# Altium project MAX96717_COUPON_V2.PrjPcb
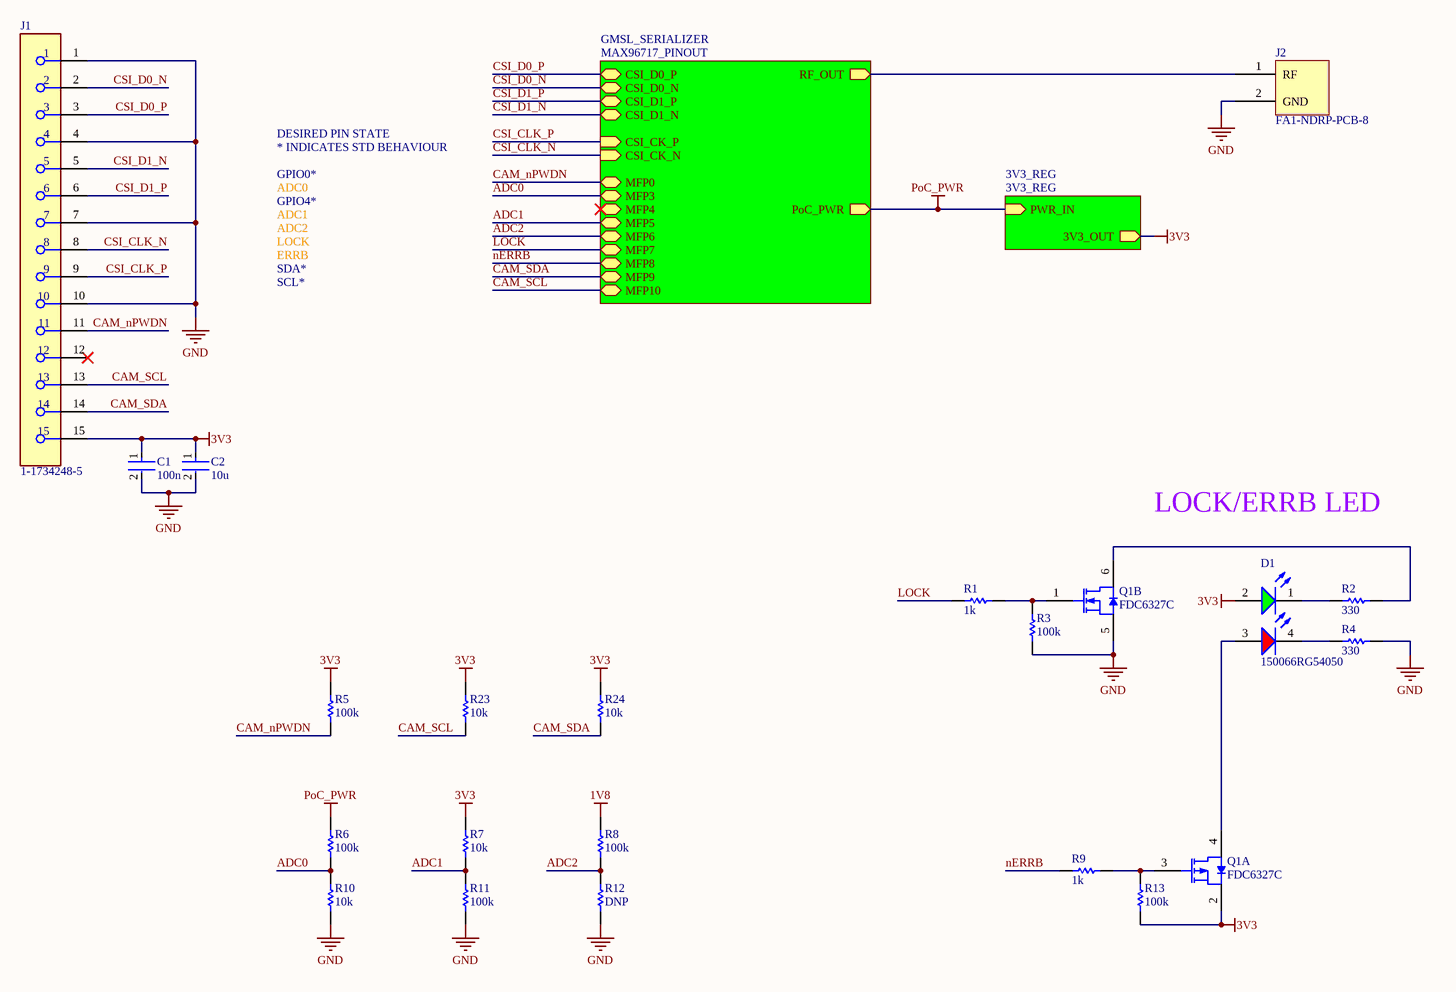
[diagram p0: MAX96717_COUPON_V2.SchDoc]
3 sheets, 67 parts. Net scope: hierarchical (ports join the sheet entries above them; power ports are global).
Board file: MAX96717_COUPON_V2.PcbDoc
Sheets:
  MAX96717_COUPON_V2.SchDoc
    GMSL_SERIALIZER = MAX96717_PINOUT.SchDoc
    3V3_REG = 3V3_REG.SchDoc

## Sheet MAX96717_COUPON_V2.SchDoc
size B; SheetNumber: 1; SheetTotal: 3

### Parts
C1  100n  [FP-0402-L_1_0_0_05-W_0_5-IPC_A]
C2  10u  [FP-0402-L_1_0_0_05-W_0_5-IPC_A]
D1  150066RG54050  [WL-SBCD_0606]
J1  1-1734248-5  [FP-1-1734248-5-MFG]
J2  FA1-NDRP-PCB-8  [FA1-NDRP-PCB-8-Footprint-1]
Q1  FDC6327C  [FAIR-SOT23-6_V]  (parts A,B of 2)
R1  1k  [R0603B]
R2  330  [R0603B]
R3  100k  [R0603B]
R4  330  [R0603B]
R5  100k  [R0603B]
R6  100k  [R0603B]
R7  10k  [R0603B]
R8  100k  [R0603B]
R9  1k  [R0603B]
R10  10k  [R0603B]
R11  100k  [R0603B]
R12  DNP  [R0603B]
R13  100k  [R0603B]
R23  10k  [R0603B]
R24  10k  [R0603B]

### Sub-sheets
3V3_REG = 3V3_REG: PWR_IN (in), 3V3_OUT (out)
GMSL_SERIALIZER = MAX96717_PINOUT: CSI_D0_P (bidir), CSI_D0_N (bidir), CSI_D1_P (bidir), CSI_D1_N (bidir), CSI_CK_P (in), CSI_CK_N (in), RF_OUT (out), PoC_PWR (out), MFP0 (bidir), MFP3 (bidir), MFP4 (bidir), MFP5 (bidir), MFP6 (bidir), MFP7 (bidir), MFP8 (bidir), MFP9 (bidir), MFP10 (bidir)

### Nets
1V8: R8.2
3V3: C1.1 C2.1 D1.2(A) J1.15 Q1.2(S) R5.2 R7.2 R13.1 R23.2 R24.2 ; sheet 3V3_REG/3V3_OUT
GND: C1.2 C2.2 J1.1 J1.4 J1.7 J1.10 J2.2(GND) Q1.5(S) R3.2 R4.1 R10.1 R11.1 R12.1
PoC_PWR: R6.2 ; sheet GMSL_SERIALIZER/PoC_PWR, sheet 3V3_REG/PWR_IN
ADC0: R6.1 R10.2 ; sheet GMSL_SERIALIZER/MFP3
ADC1: R7.1 R11.2 ; sheet GMSL_SERIALIZER/MFP5
ADC2: R8.1 R12.2 ; sheet GMSL_SERIALIZER/MFP6
CAM_nPWDN: J1.11 R5.1 ; sheet GMSL_SERIALIZER/MFP0
CAM_SCL: J1.13 R23.1 ; sheet GMSL_SERIALIZER/MFP10
CAM_SDA: J1.14 R24.1 ; sheet GMSL_SERIALIZER/MFP9
CSI_CLK_N: J1.8 ; sheet GMSL_SERIALIZER/CSI_CK_N
CSI_CLK_P: J1.9 ; sheet GMSL_SERIALIZER/CSI_CK_P
CSI_D0_N: J1.2 ; sheet GMSL_SERIALIZER/CSI_D0_N
CSI_D0_P: J1.3 ; sheet GMSL_SERIALIZER/CSI_D0_P
CSI_D1_N: J1.5 ; sheet GMSL_SERIALIZER/CSI_D1_N
CSI_D1_P: J1.6 ; sheet GMSL_SERIALIZER/CSI_D1_P
LOCK: R1.2 ; sheet GMSL_SERIALIZER/MFP7
nERRB: R9.1 ; sheet GMSL_SERIALIZER/MFP8
PoC_TAP: J2.1(RF) ; sheet GMSL_SERIALIZER/RF_OUT
NetD1_1: D1.1(K) R2.2
NetD1_3: D1.3(A) Q1.4(D)
NetD1_4: D1.4(K) R4.2
NetQ1_1: Q1.1(G) R1.1 R3.1
NetQ1_3: Q1.3(G) R9.2 R13.2
NetQ1_6: Q1.6(D) R2.1

Not connected (* = marked no-connect by the designer): J1 12*

### Notes on the sheet
- DESIRED PIN STATE
- * INDICATES STD BEHAVIOUR
- GPIO0*
- ADC0
- GPIO4*
- ADC1
- ADC2
- LOCK
- ERRB
- SDA*
- SCL*
- LOCK/ERRB LED

### Library data of the parts
C1 C2 = CMP-001-00058-1: LARGE PADS, 0402 CAP, CHANGE COMMENT TO MATCH REAL P/N; Capacitor Type: Ceramic; Min Operating Temperature: -55°C; Mounting Technology: Surface Mount; Pins: 2; Case/Package: 0402; RoHS Compliant: Yes; Max Operating Temperature: 85°C
D1 = CMP-004-00040-2: Led, Red/Grn, 180Mcd/230Mcd, 624Nm/525Nm Rohs Compliant: Yes; Source: rgled.SchLib; Component Type: Standard; Design Item ID: CMP-004-00034-2; Pins: 4
J1 = CMP-03368-000001-1: CONN FPC VERT 15POS 1.00MM SMD; Manufacturer: TE; Conn Orientation: Vertical; Conn Gender: Female; Current Rating: 1A; Is Female: yes; Number Of Contacts: 15; Pitch: 1mm; Voltage Rating: 125V; ComponentLink2URL: https://www.te.com/commerce/DocumentDelivery/DDEController?Action=showdoc&DocId=Customer+Drawing%7F1734248%7FE1%7Fpdf%7FEnglish%7FENG_CD_1734248_E1__.pdf%7F1-1734248-5; Device Class L1: Connectors; Category: Conn; Package: 0; Lead Free: Yes; Digikey Description: CONN FPC VERT 15POS 1.00MM SMD; Height: 8mm; Manufacturer Part Number: 1-1734248-5; Temperature: -20°C to +85°C; Contact Material: Gold,Nickel; Device Class L3: unset; ComponentLink2Description: Datasheet; RoHS: TRUE; Temperature Range Low: -20°C; Octopart: https://octopart.com/1-1734248-5-te+connectivity-40620898; Device Class L2: FFC / FPC; Mouser Description: FFC & FPC Connectors 15P 1.0 FPC, Zip V/T SMT; Automotive: No; Temperature Range High: +85°C; Mounting Type: Surface Mount
J2 = CMP-002-00054-1: RF F Connector, Male, Board Mount, Solder Terminal, Plug; Connector Type: RF F CONNECTOR; RoHS Compliant: Yes; Mounting Technology: Board
Q1 = CMP-2000-04939-1: Dual N & P-Channel 2.5 V Specified PowerTrench(TM) MOSFET, -55 to 150 degC, 6-Pin SOT-23, RoHS, Tape and Reel; Manufacturer: Fairchild; Typical Rise Time: 9@NChannel; Rad Hard: No; Maximum Drain Source Voltage: 20V; Typical Fall Time: 3@NChannel; Typical Turn-On Delay Time: 5@NChannel; Maximum Continuous Drain Current: 2.7@NChannel; Typical Turn-Off Delay Time: 12@NChannel; RDS-on: 80@4.5V@NChannel; Channel Mode: Enhancement; Maximum Gate Source Voltage: ±8V; Package Version: Rev. 5, 05/2015; Operating Temperature: -55to150degC; Packaging: Tape&Reel; Package Reference: SOT23-6; Package URL: https://www.fairchildsemi.com/package-drawings/MA/MA06A.pdf; Package Description: 6-Pin Small Outline Transistor, Body 2.9 x 1.6 mm, Pitch 0.95 mm; Manufacturer URL: https://www.fairchildsemi.com/; Channel Type: N; Datasheet Version: Rev. E, 07/2000; Package: 6SuperSOT; Datasheet URL: https://www.fairchildsemi.com/datasheets/FD/FDC6327C.pdf; Mounting: SurfaceMount; Category: MOSFET
R1-R6 R8 R9 R11 R13 = CMP-009-00002-14: Resistor
  R5 R6 R8 R11: Value: 100k
R7 R10 R12 R23 R24 = CMP-009-00002-14: Resistor; Value: 100k

## Sheet MAX96717_PINOUT.SchDoc
size C; SheetNumber: 3; SheetTotal: 3
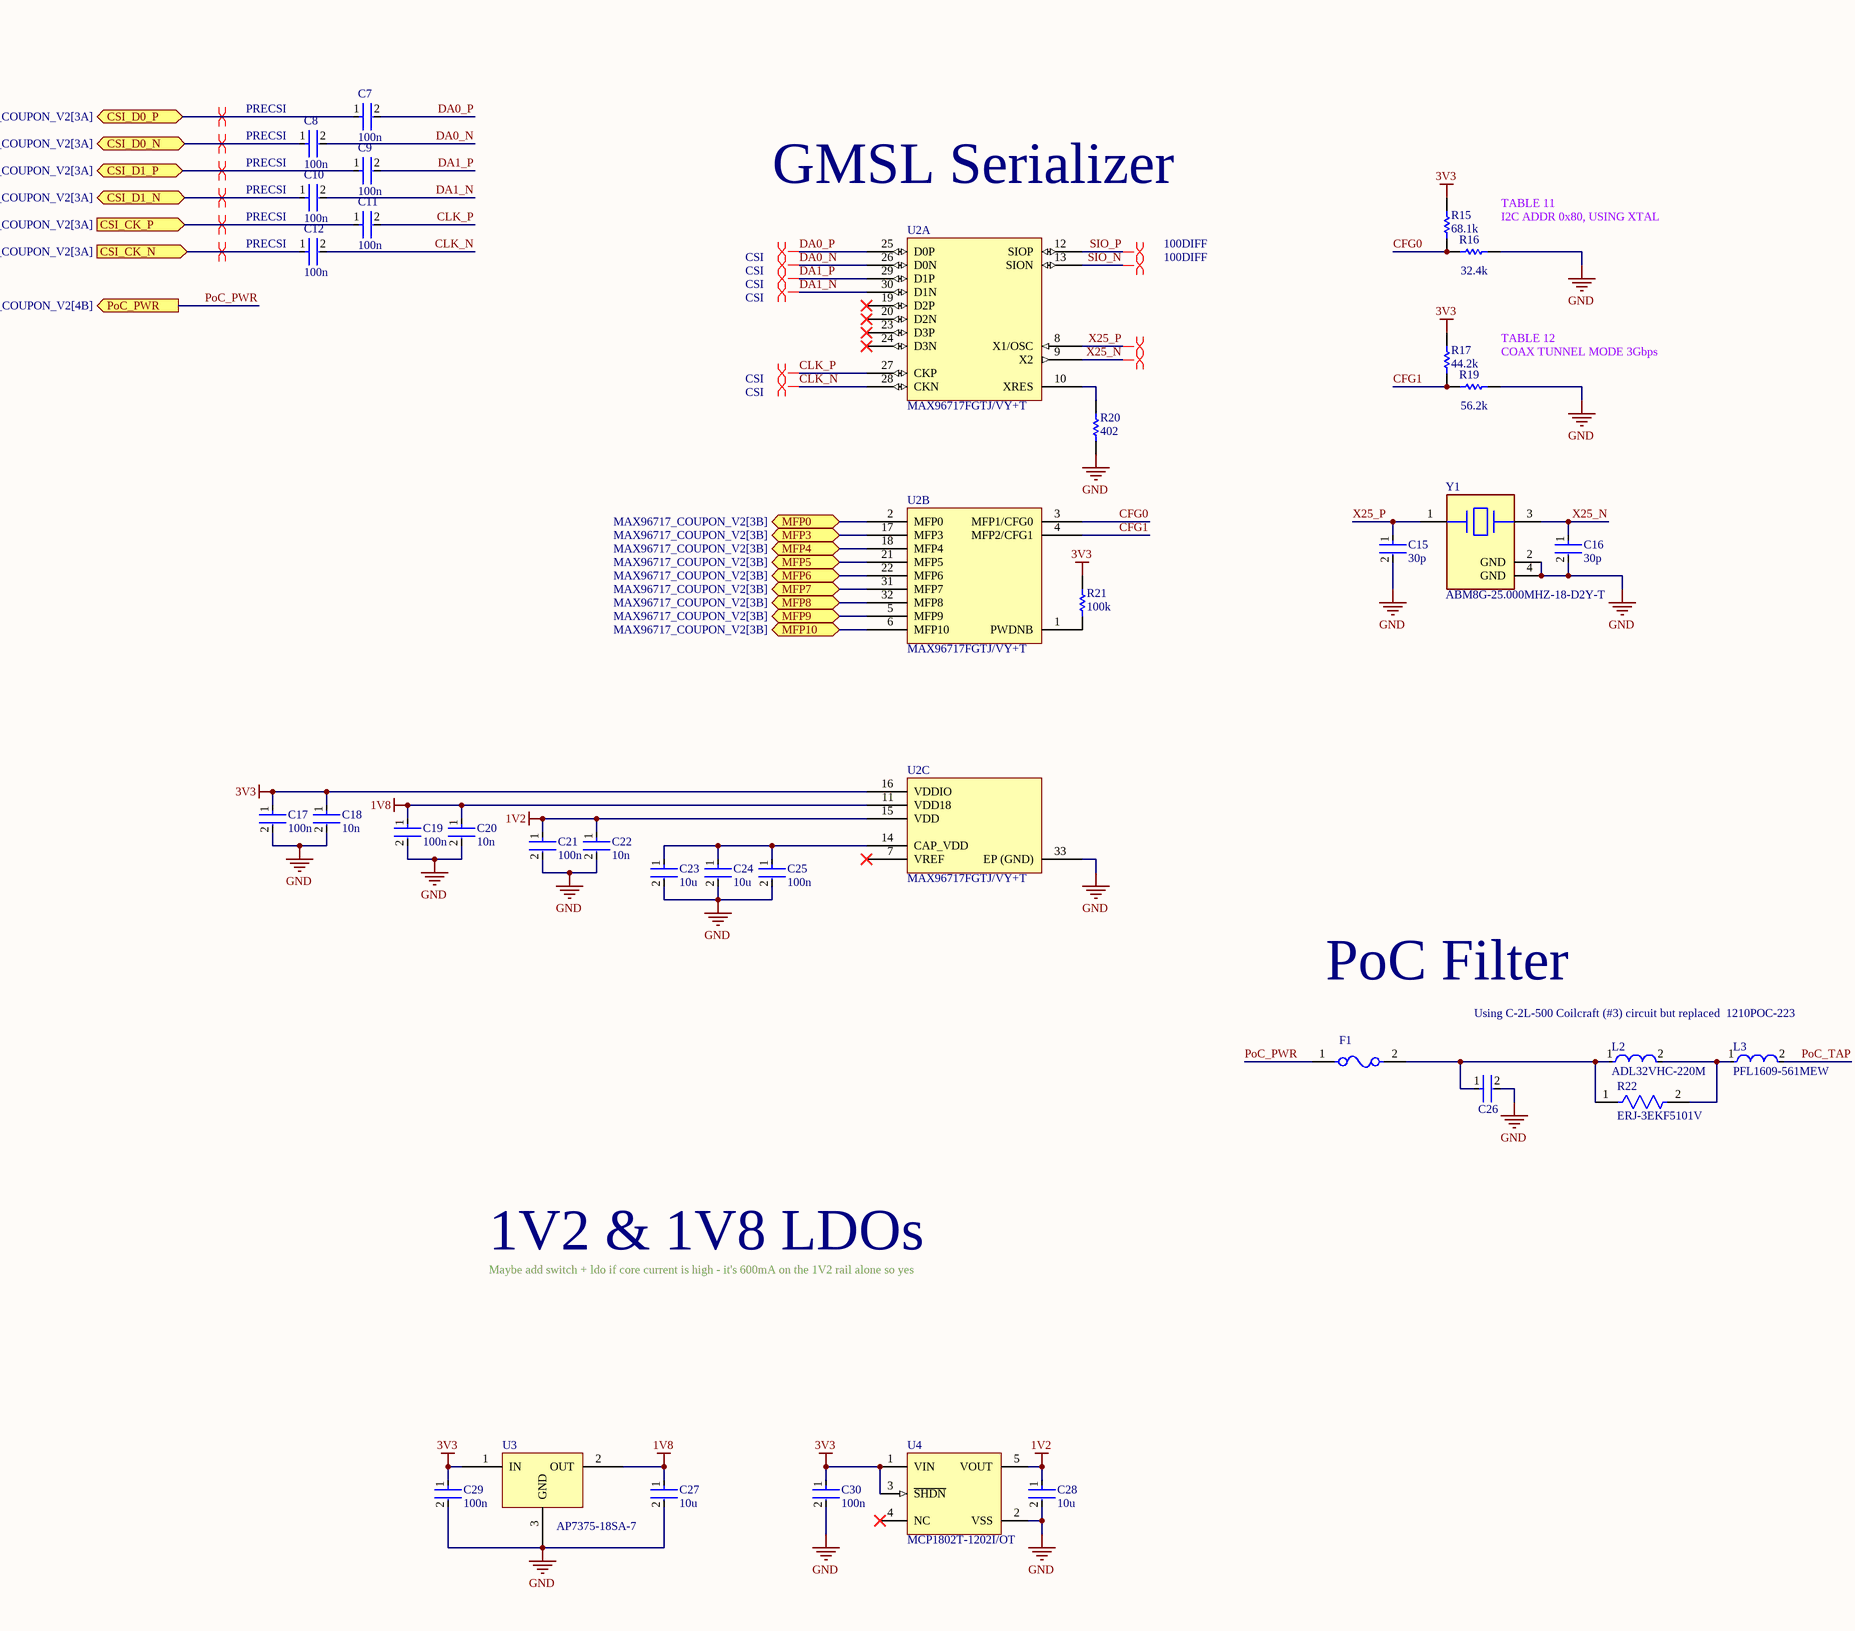
[diagram p1: MAX96717_PINOUT.SchDoc, left]
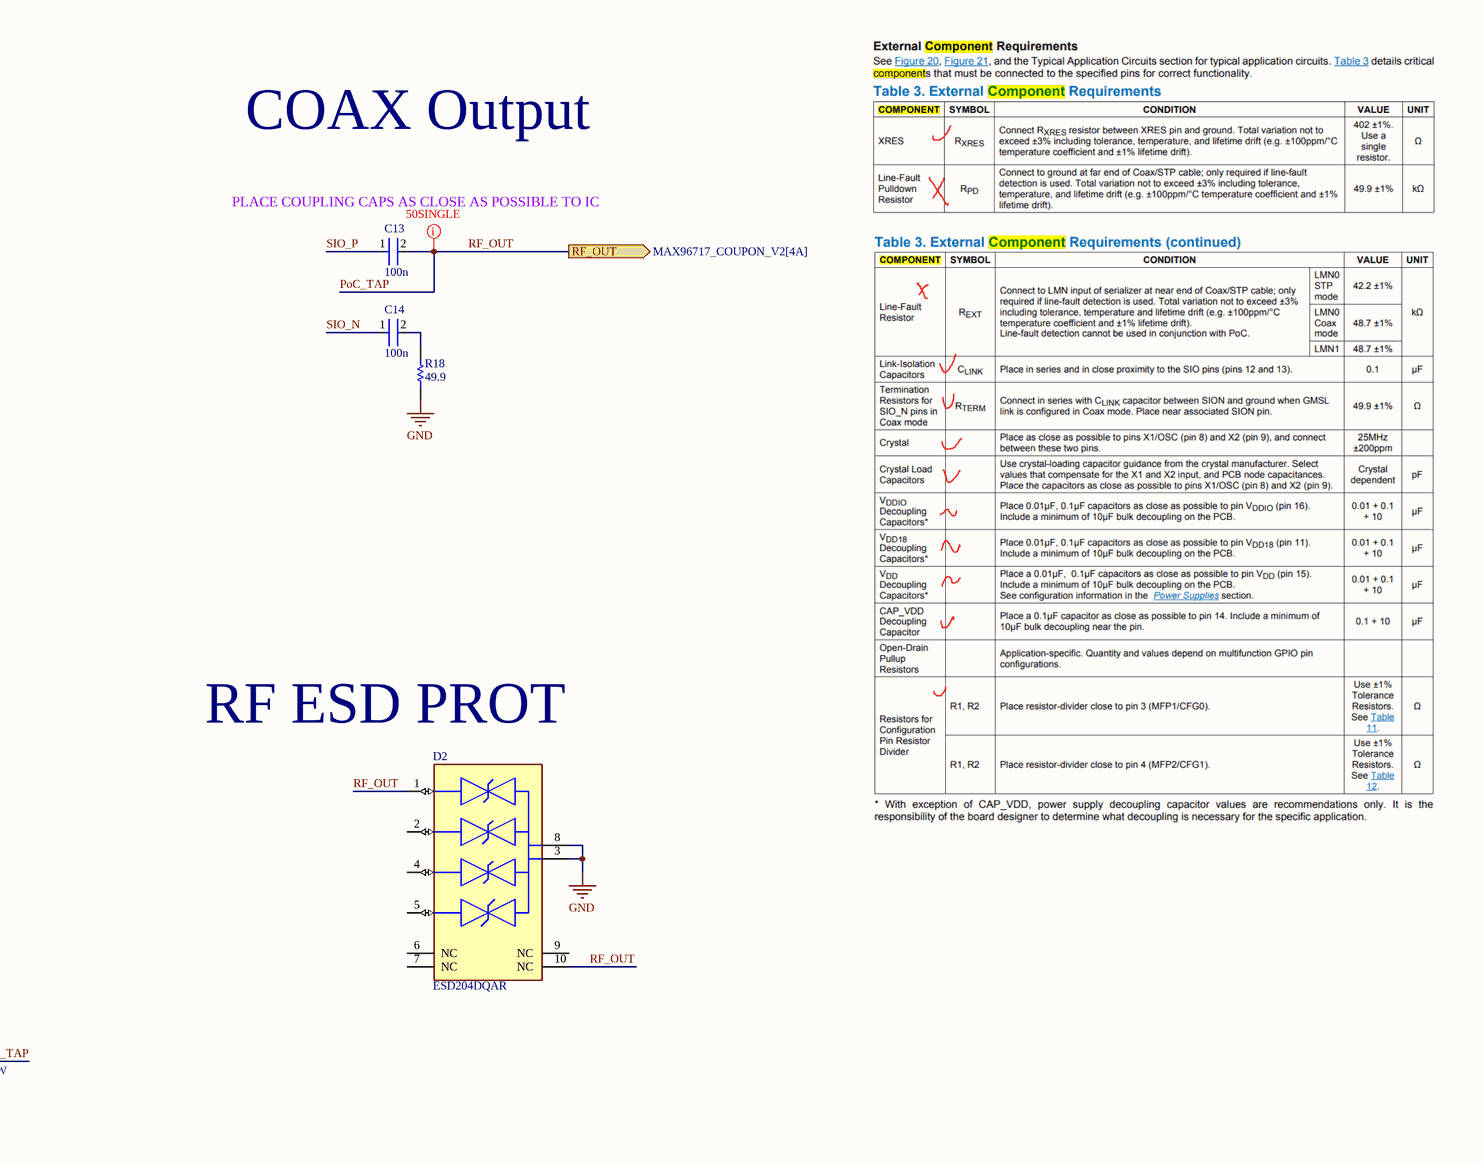
[diagram p2: MAX96717_PINOUT.SchDoc, right]

### Parts
C7  100n  [FP-0402-L_1_0_0_05-W_0_5-IPC_A]
C8  100n  [FP-0402-L_1_0_0_05-W_0_5-IPC_A]
C9  100n  [FP-0402-L_1_0_0_05-W_0_5-IPC_A]
C10  100n  [FP-0402-L_1_0_0_05-W_0_5-IPC_A]
C11  100n  [FP-0402-L_1_0_0_05-W_0_5-IPC_A]
C12  100n  [FP-0402-L_1_0_0_05-W_0_5-IPC_A]
C13  100n  [FP-0402-L_1_0_0_05-W_0_5-IPC_A]
C14  100n  [FP-0402-L_1_0_0_05-W_0_5-IPC_A]
C15  30p  [FP-0402-L_1_0_0_05-W_0_5-IPC_A]
C16  30p  [FP-0402-L_1_0_0_05-W_0_5-IPC_A]
C17  100n  [FP-0402-L_1_0_0_05-W_0_5-IPC_A]
C18  10n  [FP-0402-L_1_0_0_05-W_0_5-IPC_A]
C19  100n  [FP-0402-L_1_0_0_05-W_0_5-IPC_A]
C20  10n  [FP-0402-L_1_0_0_05-W_0_5-IPC_A]
C21  100n  [FP-0402-L_1_0_0_05-W_0_5-IPC_A]
C22  10n  [FP-0402-L_1_0_0_05-W_0_5-IPC_A]
C23  10u  [FP-0402-L_1_0_0_05-W_0_5-IPC_A]
C24  10u  [FP-0402-L_1_0_0_05-W_0_5-IPC_A]
C25  100n  [FP-0402-L_1_0_0_05-W_0_5-IPC_A]
C26  GRM21BR61E226ME44L  [FP-GRM21B-0_2-e0_2_0_7-IPC_B]  (value not drawn)
C27  10u  [FP-0402-L_1_0_0_05-W_0_5-IPC_A]
C28  10u  [FP-0402-L_1_0_0_05-W_0_5-IPC_A]
C29  100n  [FP-0402-L_1_0_0_05-W_0_5-IPC_A]
C30  100n  [FP-0402-L_1_0_0_05-W_0_5-IPC_A]
D2  ESD204DQAR  [FP-DQA0010A-MFG]
F1  MF-FSMF050X-2  [FP-MF-FSMF-MFG]  (value not drawn)
L2  ADL32VHC-220M  [FP-1210POC-MFG]
L3  PFL1609-561MEW  [FP-PFL1609-MFG]
R15  68.1k  [R0603B]
R16  32.4k  [R0603B]
R17  44.2k  [R0603B]
R18  49.9  [R0603B]
R19  56.2k  [R0603B]
R20  402  [R0603B]
R21  100k  [R0603B]
R22  ERJ-3EKF5101V  [FP-ERJ3EK-MFG]
U2  MAX96717FGTJ/VY+T  [QFN50P500X500X80_HS-33N]  (parts A,B,C of 3)
U3  AP7375-18SA-7  [AP7375-18SA-7-Footprint-1]
U4  MCP1802T-1202I/OT  [SOT-23-OT5_M]
Y1  ABM8G-25.000MHZ-18-D2Y-T  [FP-ABM8G-MFG]

### Ports
CSI_CK_N (in, see MAX96717_COUPON_V2[3A]), CSI_CK_P (in, see MAX96717_COUPON_V2[3A]), CSI_D0_N (bidir, see MAX96717_COUPON_V2[3A]), CSI_D0_P (bidir, see MAX96717_COUPON_V2[3A]), CSI_D1_N (bidir, see MAX96717_COUPON_V2[3A]), CSI_D1_P (bidir, see MAX96717_COUPON_V2[3A]), MFP0 (bidir, see MAX96717_COUPON_V2[3B]), MFP3 (bidir, see MAX96717_COUPON_V2[3B]), MFP4 (bidir, see MAX96717_COUPON_V2[3B]), MFP5 (bidir, see MAX96717_COUPON_V2[3B]), MFP6 (bidir, see MAX96717_COUPON_V2[3B]), MFP7 (bidir, see MAX96717_COUPON_V2[3B]), MFP8 (bidir, see MAX96717_COUPON_V2[3B]), MFP9 (bidir, see MAX96717_COUPON_V2[3B]), MFP10 (bidir, see MAX96717_COUPON_V2[3B]), PoC_PWR (out, see MAX96717_COUPON_V2[4B]), RF_OUT (out, see MAX96717_COUPON_V2[4A])

### Nets
1V2: C21.1 C22.1 C28.1 U2.15(VDD) U4.5(VOUT)
1V8: C19.1 C20.1 C27.1 U2.11(VDD18) U3.2(OUT)
3V3: C17.1 C18.1 C29.1 C30.1 R15.2 R17.2 R21.2 U2.16(VDDIO) U3.1(IN) U4.1(VIN) U4.3(~{SHDN})
GND: C15.2 C16.2 C17.2 C18.2 C19.2 C20.2 C21.2 C22.2 C23.2 C24.2 C25.2 C26.2 C27.2 C28.2 C29.2 C30.2 D2.3(GND) D2.8(GND) R16.1 R18.1 R19.1 R20.1 U2.33(EP_(GND)) U3.3(GND) U4.2(VSS) Y1.2(GND) Y1.4(GND)
PoC_PWR: F1.1 ; port PoC_PWR
ADC0: U2.17(MFP3) ; port MFP3
ADC1: U2.21(MFP5) ; port MFP5
ADC2: U2.22(MFP6) ; port MFP6
CAM_nPWDN: U2.2(MFP0) ; port MFP0
CAM_SCL: U2.6(MFP10) ; port MFP10
CAM_SDA: U2.5(MFP9) ; port MFP9
CFG0: R15.1 R16.2 U2.3(MFP1/CFG0)
CFG1: R17.1 R19.2 U2.4(MFP2/CFG1)
CLK_N: C12.2 U2.28(CKN)
CLK_P: C11.2 U2.27(CKP)
CSI_CLK_N: C12.1 ; port CSI_CK_N
CSI_CLK_P: C11.1 ; port CSI_CK_P
CSI_D0_N: C8.1 ; port CSI_D0_N
CSI_D0_P: C7.1 ; port CSI_D0_P
CSI_D1_N: C10.1 ; port CSI_D1_N
CSI_D1_P: C9.1 ; port CSI_D1_P
DA0_N: C8.2 U2.26(D0N)
DA0_P: C7.2 U2.25(D0P)
DA1_N: C10.2 U2.30(D1N)
DA1_P: C9.2 U2.29(D1P)
LOCK: U2.31(MFP7) ; port MFP7
nERRB: U2.32(MFP8) ; port MFP8
PoC_TAP: C13.2 D2.1(IO1) D2.10(NC) L3.2 ; port RF_OUT  [also labelled RF_OUT]
SIO_N: C14.1 U2.13(SION)
SIO_P: C13.1 U2.12(SIOP)
X25_N: C16.1 U2.9(X2) Y1.3
X25_P: C15.1 U2.8(X1/OSC) Y1.1
NetC14_2: C14.2 R18.2
NetC23_1: C23.1 C24.1 C25.1 U2.14(CAP_VDD)
NetC26_1: C26.1 F1.2 L2.1 R22.1
NetL2_2: L2.2 L3.1 R22.2
NetR20_2: R20.2 U2.10(XRES)
NetR21_1: R21.1 U2.1(PWDNB)
NetU2_18: U2.18(MFP4) ; port MFP4

Not connected (* = marked no-connect by the designer): D2 2(IO2) 4(IO3) 5(IO4) 6(NC) 7(NC) 9(NC); U2 7(VREF)* 19(D2P)* 20(D2N)* 23(D3P)* 24(D3N)*; U4 4(NC)*

### Layout directives
differential pair: X25_N, X25_P
differential pair; differential pair class CSI: CLK_N, CLK_P, DA0_N, DA0_P, DA1_N, DA1_P
differential pair; differential pair class 100DIFF: SIO_N, SIO_P
differential pair; differential pair class PRECSI: CSI_CLK_N, CSI_CLK_P, CSI_D0_N, CSI_D0_P, CSI_D1_N, CSI_D1_P
net class 50SINGLE: PoC_TAP

### Notes on the sheet
- COAX Output
- GMSL Serializer
- TABLE 11
- (near C13) PLACE COUPLING CAPS AS CLOSE AS POSSIBLE TO IC
- (near R16) I2C ADDR 0x80, USING XTAL
- TABLE 12
- (near R19) COAX TUNNEL MODE 3Gbps
- RF ESD PROT
- PoC Filter
- Using C-2L-500 Coilcraft (#3) circuit but replaced  1210POC-223
- 1V2 & 1V8 LDOs
- Maybe add switch + ldo if core current is high - it's 600mA on the 1V2 rail alone so yes

### Library data of the parts
C7-C25 C27-C30 = CMP-001-00058-1: as C1 on sheet MAX96717_COUPON_V2; Min Operating Temperature: -55°C; Mounting Technology: Surface Mount; Pins: 2; Case/Package: 0402; RoHS Compliant: Yes; Max Operating Temperature: 85°C
C26 = CMP-2007-03222-3: Chip Multilayer Ceramic Capacitors for General Purpose, 0805, 22uF, X5R, 15%, 20%, 25V; Case/Package: 0805; Depth: 1.25mm; Resistor Type: Ceramic; Voltage Rating: 25V; Lead Free: Lead Free; Voltage Rating (DC): 25V; Case Code (Metric): 2012; Thickness: 0.057inch; REACH SVHC: No SVHC; Material: Ceramic; Tolerance: 20%; Length: 2mm; Capacitance: 22uF; Case Code (Imperial): 0805; Max Operating Temperature: 85°C; Termination: SMD/SMT; Weight: 0.000335oz; Dielectric: X5R; Packaging: Tape and Reel; Voltage: 25V; Package Quantity: 3000; Height: 1.25mm; Mount: Surface Mount; Width: 1.25mm; Min Operating Temperature: -55°C
D2 = CMP-04989-000002-1: 4-CHANNEL LOW-CAPACITANCE SURGE; Manufacturer: Texas Instruments; Value: 0.55pF; Reverse Standoff Voltage: 3.6V; Standoff Height: 0mm; Breakdown Voltage: 5.5V; Peak Pulse Current: 5.5A; Clamping Voltage: 11.5V; Direction: Bidirectional; Peak Pulse Power: 50W; Number Of Channels: 4; Ambient Temperature Range High: +125°C; ComponentLink2Description: Datasheet; Height: 0.55mm; Lead Free: Yes; Device Class L3: unset; Temperature Range High: +125°C; Temperature Range Low: -40°C; Package: DQA0010A; Temperature: -40°C to +125°C; Capacitance: 0.55pF; RoHS: TRUE; Mouser Description: 4-Channel Low-Capacitance Surge and ESD Protection Diode 10-USON -40 to 125; Category: Diode; Device Class L1: Circuit Protection; Octopart: https://octopart.com/esd204dqar-texas+instruments-89917476; Device Class L2: TVS Diodes; Ambient Temperature Range Low: -40°C; Manufacturer Part Number: ESD204DQAR; ComponentLink2URL: http://www.ti.com/lit/ds/symlink/esd204.pdf; Automotive: No; Digikey Description: 4-CHANNEL LOW-CAPACITANCE SURGE
F1 = CMP-07400-000010-1: PTC RESET FUSE 6V 500MA 0603; Manufacturer: Bourns Inc.; Trip Current: 1A; Current Rating: 40A; Hold Current: 0.5A; Resistance: 0.1-0.8Ω; Value: 0.1-0.8Ω; Trip Time: 0.1s; Mouser Description: Resettable Fuses - PPTC 6volts 40amps; Category: Fuse; Digikey Description: PTC RESET FUSE 6V 500MA 0603; Temperature: -40°C to +85°C; Device Class L3: unset; Automotive: No; RoHS: TRUE; Ambient Temperature Range High: +85°C; Device Class L2: PTC Resettable Fuses; Temperature Range High: +85°C; Voltage Rating: 6V; Package: MF-FSMF; Manufacturer Part Number: MF-FSMF050X-2; Ambient Temperature Range Low: -40°C; Lead Free: Yes; ComponentLink2Description: Datasheet; Octopart: https://octopart.com/mf-fsmf050x-2-bourns-10470804; ComponentLink2URL: https://www.bourns.com/docs/Product-Datasheets/mffsmf.pdf; Temperature Range Low: -40°C; Height: 1mm; Device Class L1: Circuit Protection
L2 = CMP-11268-000041-1: NOT COILCRAFT - ACTUAL P# --> ADL32VHC-220M / - Power Injection Chokes for PoC; Manufacturer Part Number: 1210POC-223MRC; Value: 22uH; Core Material: Ferrite; Saturation Current: 720mA; Series Resistance: 0.88Ω; Rms Current: 700mA; Automotive Grade: Grade 1; Self Resonant Frequency: 70MHz; Test Frequency: 100kHz; Tolerance: 20%; Ambient Temperature Range High: +125°C; Manufacturer: coilcraft; Octopart: https://octopart.com/1210poc-223mrc-coilcraft-103207315; Category: Ind; Device Class L2: Inductors; RoHS: TRUE; Device Class L3: Fixed Inductors; Package: 1210POC; Ambient Temperature Range Low: -40°C; ComponentLink2URL: https://drive.google.com/open?id=15FlOq8Y4YbRFohfA_cJ40jgnqs8va2Mh; Lead Free: Yes; Inductance: 22uH; Device Class L1: Passive Components; ComponentLink2Description: Datasheet; Automotive: Yes; Height: 3mm
L3 = CMP-11268-000007-1: Fixed Inductors PFL1609 Low Profile 0.56 uH 20 % 1.4 A; Manufacturer: coilcraft; Rms Current: 1100mA; Self Resonant Frequency: 600MHz; Core Material: Composite; Tolerance: 20%; Value: 0.56uH; Automotive Grade: Grade 1; Saturation Current: 710mA; Test Frequency: 7.9MHz; Shielding: true; Series Resistance: 130mΩ; Lead Free: Yes; Device Class L1: Passive Components; Package: PFL1609; Octopart: https://octopart.com/pfl1609-561mew-coilcraft-20329171; ComponentLink2URL: https://www.coilcraft.com/pdfs/pfl1609.pdf; Manufacturer Part Number: PFL1609-561MEW; Ambient Temperature Range Low: -40°C; Composition: Wirewound; Inductance: 0.56uH; Device Class L2: Inductors; Category: Ind; Device Class L3: Fixed Inductors; Mouser Description: Fixed Inductors PFL1609 Low Profile 0.56 uH 20 % 1.4 A; Automotive: Yes; ComponentLink2Description: Datasheet; Ambient Temperature Range High: +105°C; Height: 0.95mm; RoHS: TRUE
R15-R20 = CMP-009-00002-14: Resistor; Value: 100k
R21 = CMP-009-00002-14: Resistor; Value: 100k
R22 = CMP-2000-00540-8: RES SMD 5.1K OHM 1% 1/10W 0603; Power Rating: 100mW; Temperature Coefficient: 100ppm/°C; Voltage Rating: 75V; Resistance: 5.1kR; Military Standard: Not; Case/Package: 0603; Packaging: Tape and Reel; Package Quantity: 1; Reach SVHC Compliant: Yes; Lead Free: Lead Free; Mount: Surface Mount; Size Code: 0603; Depth: 0.8mm; Resistance Tolerance: 1%; Number of Terminations: 2; Resistor Type: Thick Film; Width: 0.8mm; Construction: Rectangular; Series: ERJ; Radiation Hardening: No; Max Operating Temperature: 155°C; Features: Automotive AEC-Q200; Tolerance: 1%; Voltage Rating (DC): 75V; Length: 1.6mm; RoHS Compliant: Yes; Min Operating Temperature: -55°C; Case Code (Metric): 1608; Termination: SMD/SMT; Weight: 7.1E-05oz; Max Power Dissipation: 100mW; Contact Plating: Tin; Height: 0.022inch; Case Code (Imperial): 0603
U2 = CMP-015-00012-2: 3Gbps Serializer TQFN-32 Serializers / Deserializers ROHS
U3 = CMP-019-00042-1: Fixed Positive LDO Regulator; RoHS Compliant: Yes
U4 = CMP-0136-00731-1: 300 mA, High PSRR, Low Quiescent Current LDO, 5-Pin SOT-23, Industrial Temperature, Tape and Reel; DatasheetVersion: revB, Jan-2009; PackageReference: SOT-23-OT5; Code_IPC: SOT23-5; PackageDescription: 5-Lead Plastic Small Outline Transistor (OT) [SOT-23]; PackageVersion: revBB, Aug-2009
Y1 = CMP-2000-05733-3: Crystal 25MHz ±20ppm (Tol) ±30ppm (Stability) 18pF FUND 60Ω 4-Pin SMD T/R; Series Resistance: 60R; Length: 3.2mm; Depth: 2.5mm; Packaging: Tape and Reel; Min Operating Temperature: -40°C; Operating Frequency: 25 MHz; Lead Free: Lead Free; Number of Pins: 4; Frequency Tolerance: 20ppm; Radiation Hardening: No; Max Operating Temperature: 85°C; Termination: SMD/SMT; Frequency Stability: 30ppm; Frequency: 25MHz; Series: ABM8G; Mount: Surface Mount; Package Quantity: 1000; Height: 0.039inch; Width: 0.098inch; Case/Package: CSMD; ESR (Equivalent Series Resistance): 60R; Load Capacitance: 18pF; Tolerance: 20ppm

## Sheet 3V3_REG.SchDoc
size A4; SheetNumber: 2; SheetTotal: 3
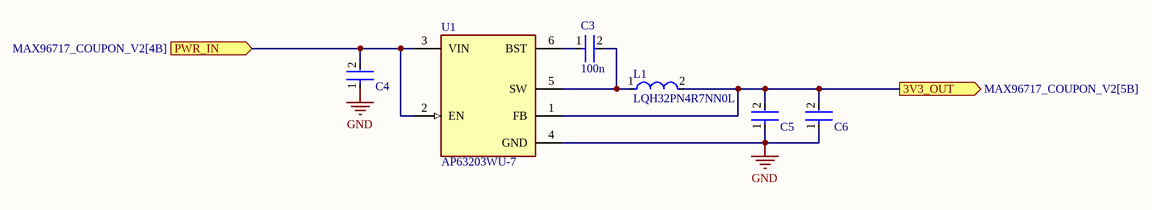
[diagram p3: 3V3_REG.SchDoc]

### Parts
C3  100n  [FP-0402-L_1_0_0_05-W_0_5-IPC_A]
C4  GRM21BR61E226ME44L  [FP-GRM21B-0_2-e0_2_0_7-IPC_B]  (value not drawn)
C5  GRM21BR61E226ME44L  [FP-GRM21B-0_2-e0_2_0_7-IPC_B]  (value not drawn)
C6  GRM21BR61E226ME44L  [FP-GRM21B-0_2-e0_2_0_7-IPC_B]  (value not drawn)
L1  LQH32PN4R7NN0L  [FP-LQH32PB_N0-MFG]
U1  AP63203WU-7  [FP-TSOT26-MFG]

### Ports
3V3_OUT (out, see MAX96717_COUPON_V2[5B]), PWR_IN (in, see MAX96717_COUPON_V2[4B])

### Nets
3V3: C5.2 C6.2 L1.2 U1.1(FB) ; port 3V3_OUT
GND: C4.1 C5.1 C6.1 U1.4(GND)
PoC_PWR: C4.2 U1.2(EN) U1.3(VIN) ; port PWR_IN
NetC3_1: C3.1 U1.6(BST)
NetC3_2: C3.2 L1.1 U1.5(SW)

### Library data of the parts
C3 = CMP-001-00058-1: as C1 on sheet MAX96717_COUPON_V2; Min Operating Temperature: -55°C; Mounting Technology: Surface Mount; Pins: 2; Case/Package: 0402; RoHS Compliant: Yes; Max Operating Temperature: 85°C
C4-C6 = CMP-2007-03222-3: as C26 on sheet MAX96717_PINOUT; Case/Package: 0805; Depth: 1.25mm; Resistor Type: Ceramic; Voltage Rating: 25V; Lead Free: Lead Free; Voltage Rating (DC): 25V; Case Code (Metric): 2012; Thickness: 0.057inch; REACH SVHC: No SVHC; Material: Ceramic; Tolerance: 20%; Length: 2mm; Capacitance: 22uF; Case Code (Imperial): 0805; Max Operating Temperature: 85°C; Termination: SMD/SMT; Weight: 0.000335oz; Dielectric: X5R; Packaging: Tape and Reel; Voltage: 25V; Package Quantity: 3000; Height: 1.25mm; Mount: Surface Mount; Width: 1.25mm; Min Operating Temperature: -55°C
L1 = CMP-06042-015002-1: Wire Wound Ferrite Inductor for Power Lines 4.7μH ±30% 0.216Ω 1000mA 1210; DC Current: 1A; Self Resonant Frequency: 40MHz; Test Frequency: 1MHz; Inductance: 4.7uH; Shielding: Shielded; DC Resistance (DCR): 180mR; Case/Package: 1210; Lead Free: Lead Free; Inductance Tolerance: 30%; Depth: 2.8mm; Radiation Hardening: No; Case Code (Imperial): 1210; Length: 3.2mm; Height - Seated (Max): 0.067inch; Current Rating: 1A; Max DC Current: 1A; Core Material: Ferrite; Resistor Type: Wirewound; Max Operating Temperature: 85°C; Weight: 0.001552oz; Tolerance: 30%; Width: 0.098inch; Mount: Surface Mount; Height: 2mm; Termination: SMD/SMT; Package Quantity: 2000; Min Operating Temperature: -40°C; Saturation Current: 1A; Packaging: Tape and Reel; Case Code (Metric): 3225; REACH SVHC: No SVHC; Military Standard: Not
U1 = CMP-12757-000006-1: IC REG BUCK 3.3V 2A TSOT26; Manufacturer: Diodes Inc.; Output Type: Fixed; Min Supply Voltage: 3.8V; Number Of Outputs: 1; Max Junction Temp: +160°C; Nominal Supply Current: 22uA; Standoff Height: 0.01mm; Switching Frequency: 1.1MHz; Max Supply Voltage: 32V; ComponentLink2Description: Datasheet; Device Class L1: Integrated Circuits (ICs); Temperature: to +160°C; Device Class L3: Voltage Regulators - Switching; RoHS: TRUE; Octopart: https://octopart.com/ap63203wu-7-diodes+inc.-98099550; Output Voltage: 3.3V; Lead Free: Yes; ComponentLink2URL: https://www.diodes.com/assets/Datasheets/AP63200-AP63201-AP63203-AP63205.pdf; Digikey Description: IC REG BUCK 3.3V 2A TSOT26; Footprint Url: https://www.diodes.com/assets/Package-Files/TSOT26.pdf; Ambient Temperature Range High: +85°C; Height: 1mm; Automotive: No; Temperature Range High: +160°C; Switching Topology: Buck; Output Current: 2A; Package: TSOT26; Category: IC; Mouser Description: AP63203 Series 3.3 V 2 A SMT Fixed Low IQ Synchronous Buck - TSOT-26; Device Class L2: Power Management ICs; Ambient Temperature Range Low: -40°C; Manufacturer Part Number: AP63203WU-7

## Nets that join several sheets
1V8: MAX96717_COUPON_V2 (R8.2), MAX96717_PINOUT (5 pins)
3V3: MAX96717_COUPON_V2 (10 pins), MAX96717_PINOUT (11 pins), 3V3_REG (C5.2 C6.2 L1.2 U1.1)
GND: MAX96717_COUPON_V2 (13 pins), MAX96717_PINOUT (27 pins), 3V3_REG (C4.1 C5.1 C6.1 U1.4)
PoC_PWR: MAX96717_COUPON_V2 (R6.2), MAX96717_PINOUT (F1.1), 3V3_REG (C4.2 U1.2 U1.3)
ADC0: MAX96717_COUPON_V2 (R6.1 R10.2), MAX96717_PINOUT (U2.17)
ADC1: MAX96717_COUPON_V2 (R7.1 R11.2), MAX96717_PINOUT (U2.21)
ADC2: MAX96717_COUPON_V2 (R8.1 R12.2), MAX96717_PINOUT (U2.22)
CAM_nPWDN: MAX96717_COUPON_V2 (J1.11 R5.1), MAX96717_PINOUT (U2.2)
CAM_SCL: MAX96717_COUPON_V2 (J1.13 R23.1), MAX96717_PINOUT (U2.6)
CAM_SDA: MAX96717_COUPON_V2 (J1.14 R24.1), MAX96717_PINOUT (U2.5)
CSI_CLK_N: MAX96717_COUPON_V2 (J1.8), MAX96717_PINOUT (C12.1)
CSI_CLK_P: MAX96717_COUPON_V2 (J1.9), MAX96717_PINOUT (C11.1)
CSI_D0_N: MAX96717_COUPON_V2 (J1.2), MAX96717_PINOUT (C8.1)
CSI_D0_P: MAX96717_COUPON_V2 (J1.3), MAX96717_PINOUT (C7.1)
CSI_D1_N: MAX96717_COUPON_V2 (J1.5), MAX96717_PINOUT (C10.1)
CSI_D1_P: MAX96717_COUPON_V2 (J1.6), MAX96717_PINOUT (C9.1)
LOCK: MAX96717_COUPON_V2 (R1.2), MAX96717_PINOUT (U2.31)
nERRB: MAX96717_COUPON_V2 (R9.1), MAX96717_PINOUT (U2.32)
PoC_TAP: MAX96717_COUPON_V2 (J2.1), MAX96717_PINOUT (C13.2 D2.1 D2.10 L3.2)